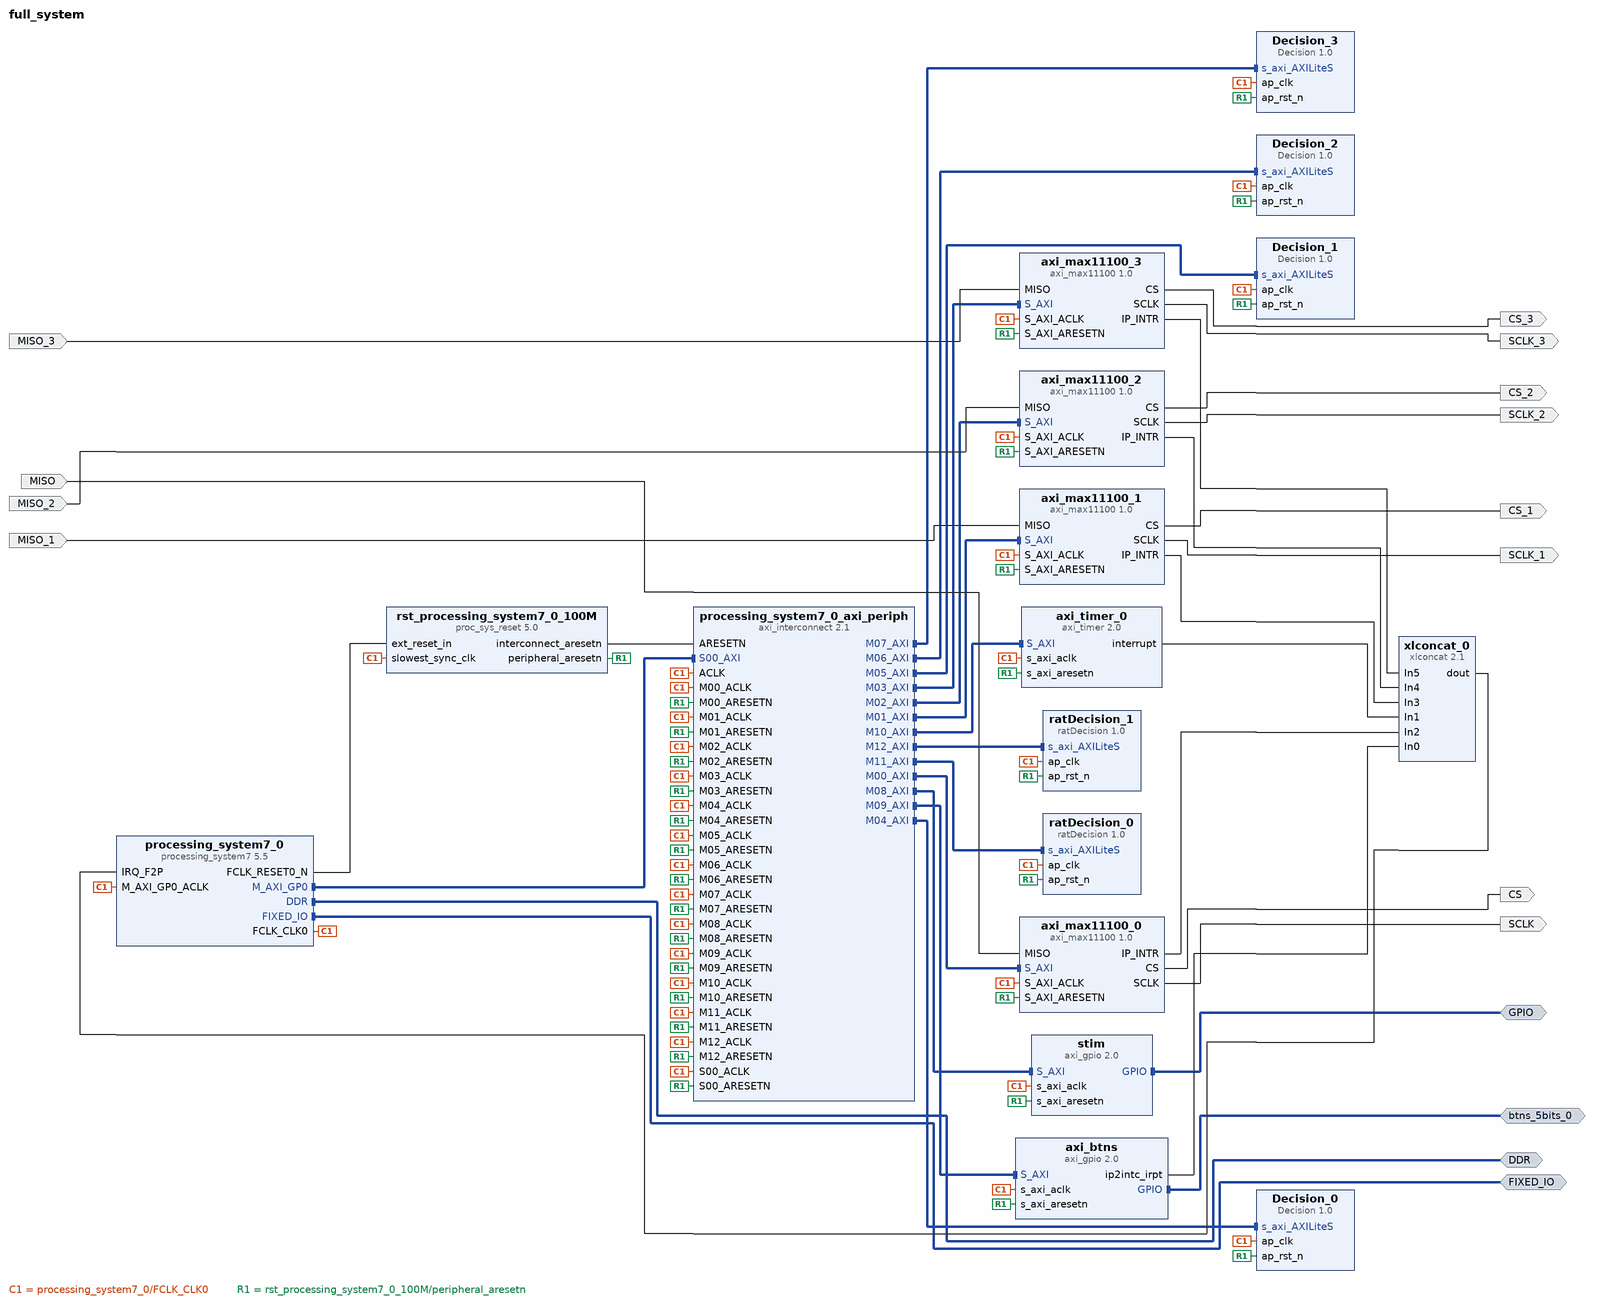
[diagram p0: block diagram of the top level]
# Vivado block design full_system, Vivado 2016.2
create_bd_design full_system

create_bd_intf_port -mode Master -vlnv xilinx.com:interface:ddrx_rtl:1.0 DDR
create_bd_intf_port -mode Master -vlnv xilinx.com:display_processing_system7:fixedio_rtl:1.0 FIXED_IO
create_bd_intf_port -mode Master -vlnv xilinx.com:interface:gpio_rtl:1.0 btns_5bits_0
create_bd_intf_port -mode Master -vlnv xilinx.com:interface:gpio_rtl:1.0 GPIO
create_bd_port -dir O CS
create_bd_port -dir O SCLK
create_bd_port -dir I MISO
create_bd_port -dir O SCLK_1
create_bd_port -dir I MISO_1
create_bd_port -dir O CS_1
create_bd_port -dir O SCLK_2
create_bd_port -dir O CS_2
create_bd_port -dir I MISO_2
create_bd_port -dir O SCLK_3
create_bd_port -dir O CS_3
create_bd_port -dir I MISO_3

create_bd_cell -type ip -vlnv xilinx.com:ip:processing_system7:5.5 processing_system7_0
set_property -dict [list \
  CONFIG.PCW_FPGA0_PERIPHERAL_FREQMHZ 100 \
  CONFIG.PCW_USE_FABRIC_INTERRUPT 1 \
  CONFIG.PCW_IRQ_F2P_INTR 1 \
  CONFIG.PCW_UART1_PERIPHERAL_ENABLE 1 \
] [get_bd_cells processing_system7_0]
create_bd_cell -type ip -vlnv PaceAce:user:axi_max11100:1.0 axi_max11100_0
set_property -dict {CONFIG.C_S_AXI_ADDR_WIDTH 32} [get_bd_cells axi_max11100_0]
create_bd_cell -type ip -vlnv PaceAce:user:axi_max11100:1.0 axi_max11100_1
create_bd_cell -type ip -vlnv PaceAce:user:axi_max11100:1.0 axi_max11100_2
set_property -dict {CONFIG.C_S_AXI_ADDR_WIDTH 32} [get_bd_cells axi_max11100_2]
create_bd_cell -type ip -vlnv PaceAce:user:axi_max11100:1.0 axi_max11100_3
set_property -dict {CONFIG.C_S_AXI_ADDR_WIDTH 32} [get_bd_cells axi_max11100_3]
create_bd_cell -type ip -vlnv xilinx.com:ip:axi_gpio:2.0 stim
set_property -dict [list \
  CONFIG.C_GPIO_WIDTH 16 \
  CONFIG.C_ALL_INPUTS 0 \
  CONFIG.C_INTERRUPT_PRESENT 0 \
  CONFIG.USE_BOARD_FLOW true \
  CONFIG.GPIO_BOARD_INTERFACE Custom \
  CONFIG.C_ALL_OUTPUTS 1 \
] [get_bd_cells stim]
create_bd_cell -type ip -vlnv xilinx.com:ip:axi_gpio:2.0 axi_btns
set_property -dict [list \
  CONFIG.C_INTERRUPT_PRESENT 1 \
  CONFIG.USE_BOARD_FLOW true \
  CONFIG.GPIO_BOARD_INTERFACE btns_5bits \
] [get_bd_cells axi_btns]
create_bd_cell -type ip -vlnv xilinx.com:ip:axi_timer:2.0 axi_timer_0
create_bd_cell -type ip -vlnv xilinx.com:ip:xlconcat:2.1 xlconcat_0
set_property -dict {CONFIG.NUM_PORTS 6} [get_bd_cells xlconcat_0]
create_bd_cell -type ip -vlnv xilinx.com:ip:axi_interconnect:2.1 processing_system7_0_axi_periph
set_property -dict {CONFIG.NUM_MI 13} [get_bd_cells processing_system7_0_axi_periph]
create_bd_cell -type ip -vlnv xilinx.com:ip:proc_sys_reset:5.0 rst_processing_system7_0_100M
create_bd_cell -type ip -vlnv PaceAce:PaceAce:Decision:1.0 Decision_0
create_bd_cell -type ip -vlnv PaceAce:PaceAce:Decision:1.0 Decision_1
create_bd_cell -type ip -vlnv PaceAce:PaceAce:Decision:1.0 Decision_2
create_bd_cell -type ip -vlnv PaceAce:PaceAce:Decision:1.0 Decision_3
create_bd_cell -type ip -vlnv PaceAce:hls:ratDecision:1.0 ratDecision_0
create_bd_cell -type ip -vlnv PaceAce:hls:ratDecision:1.0 ratDecision_1

# ---- connections ----

connect_bd_intf_net [get_bd_intf_pins processing_system7_0/M_AXI_GP0] [get_bd_intf_pins processing_system7_0_axi_periph/S00_AXI]
connect_bd_intf_net [get_bd_intf_pins processing_system7_0_axi_periph/M00_AXI] [get_bd_intf_pins axi_max11100_0/S_AXI]
connect_bd_intf_net [get_bd_intf_pins processing_system7_0_axi_periph/M01_AXI] [get_bd_intf_pins axi_max11100_1/S_AXI]
connect_bd_intf_net [get_bd_intf_pins processing_system7_0_axi_periph/M02_AXI] [get_bd_intf_pins axi_max11100_2/S_AXI]
connect_bd_intf_net [get_bd_intf_pins processing_system7_0_axi_periph/M03_AXI] [get_bd_intf_pins axi_max11100_3/S_AXI]
connect_bd_intf_net [get_bd_intf_pins processing_system7_0_axi_periph/M08_AXI] [get_bd_intf_pins stim/S_AXI]
connect_bd_intf_net [get_bd_intf_pins processing_system7_0_axi_periph/M09_AXI] [get_bd_intf_pins axi_btns/S_AXI]
connect_bd_intf_net [get_bd_intf_pins processing_system7_0_axi_periph/M10_AXI] [get_bd_intf_pins axi_timer_0/S_AXI]
connect_bd_intf_net [get_bd_intf_pins processing_system7_0_axi_periph/M04_AXI] [get_bd_intf_pins Decision_0/s_axi_AXILiteS]
connect_bd_intf_net [get_bd_intf_pins processing_system7_0_axi_periph/M05_AXI] [get_bd_intf_pins Decision_1/s_axi_AXILiteS]
connect_bd_intf_net [get_bd_intf_pins processing_system7_0_axi_periph/M06_AXI] [get_bd_intf_pins Decision_2/s_axi_AXILiteS]
connect_bd_intf_net [get_bd_intf_pins processing_system7_0_axi_periph/M07_AXI] [get_bd_intf_pins Decision_3/s_axi_AXILiteS]
connect_bd_intf_net [get_bd_intf_pins processing_system7_0_axi_periph/M11_AXI] [get_bd_intf_pins ratDecision_0/s_axi_AXILiteS]
connect_bd_intf_net [get_bd_intf_pins processing_system7_0_axi_periph/M12_AXI] [get_bd_intf_pins ratDecision_1/s_axi_AXILiteS]
connect_bd_intf_net [get_bd_intf_ports DDR] [get_bd_intf_pins processing_system7_0/DDR]
connect_bd_intf_net [get_bd_intf_ports FIXED_IO] [get_bd_intf_pins processing_system7_0/FIXED_IO]
connect_bd_intf_net -intf_net axi_gpio_1_GPIO [get_bd_intf_ports btns_5bits_0] [get_bd_intf_pins axi_btns/GPIO]
connect_bd_intf_net -intf_net axi_gpio_0_GPIO [get_bd_intf_ports GPIO] [get_bd_intf_pins stim/GPIO]
connect_bd_net [get_bd_pins processing_system7_0/FCLK_CLK0] \
  [get_bd_pins processing_system7_0/M_AXI_GP0_ACLK] [get_bd_pins rst_processing_system7_0_100M/slowest_sync_clk] \
  [get_bd_pins axi_max11100_0/S_AXI_ACLK] [get_bd_pins axi_max11100_1/S_AXI_ACLK] [get_bd_pins axi_max11100_2/S_AXI_ACLK] \
  [get_bd_pins axi_max11100_3/S_AXI_ACLK] [get_bd_pins stim/s_axi_aclk] [get_bd_pins axi_btns/s_axi_aclk] \
  [get_bd_pins axi_timer_0/s_axi_aclk] [get_bd_pins Decision_0/ap_clk] [get_bd_pins Decision_1/ap_clk] \
  [get_bd_pins Decision_2/ap_clk] [get_bd_pins Decision_3/ap_clk] [get_bd_pins processing_system7_0_axi_periph/S00_ACLK] \
  [get_bd_pins processing_system7_0_axi_periph/ACLK] [get_bd_pins processing_system7_0_axi_periph/M00_ACLK] \
  [get_bd_pins processing_system7_0_axi_periph/M01_ACLK] [get_bd_pins processing_system7_0_axi_periph/M02_ACLK] \
  [get_bd_pins processing_system7_0_axi_periph/M03_ACLK] [get_bd_pins processing_system7_0_axi_periph/M04_ACLK] \
  [get_bd_pins processing_system7_0_axi_periph/M05_ACLK] [get_bd_pins processing_system7_0_axi_periph/M06_ACLK] \
  [get_bd_pins processing_system7_0_axi_periph/M07_ACLK] [get_bd_pins processing_system7_0_axi_periph/M08_ACLK] \
  [get_bd_pins processing_system7_0_axi_periph/M09_ACLK] [get_bd_pins processing_system7_0_axi_periph/M10_ACLK] \
  [get_bd_pins ratDecision_0/ap_clk] [get_bd_pins processing_system7_0_axi_periph/M11_ACLK] \
  [get_bd_pins ratDecision_1/ap_clk] [get_bd_pins processing_system7_0_axi_periph/M12_ACLK]
connect_bd_net [get_bd_pins processing_system7_0/FCLK_RESET0_N] [get_bd_pins rst_processing_system7_0_100M/ext_reset_in]
connect_bd_net [get_bd_pins rst_processing_system7_0_100M/peripheral_aresetn] \
  [get_bd_pins axi_max11100_0/S_AXI_ARESETN] [get_bd_pins axi_max11100_1/S_AXI_ARESETN] \
  [get_bd_pins axi_max11100_2/S_AXI_ARESETN] [get_bd_pins axi_max11100_3/S_AXI_ARESETN] [get_bd_pins stim/s_axi_aresetn] \
  [get_bd_pins axi_btns/s_axi_aresetn] [get_bd_pins axi_timer_0/s_axi_aresetn] [get_bd_pins Decision_0/ap_rst_n] \
  [get_bd_pins Decision_1/ap_rst_n] [get_bd_pins Decision_2/ap_rst_n] [get_bd_pins Decision_3/ap_rst_n] \
  [get_bd_pins processing_system7_0_axi_periph/S00_ARESETN] [get_bd_pins processing_system7_0_axi_periph/M00_ARESETN] \
  [get_bd_pins processing_system7_0_axi_periph/M01_ARESETN] [get_bd_pins processing_system7_0_axi_periph/M02_ARESETN] \
  [get_bd_pins processing_system7_0_axi_periph/M03_ARESETN] [get_bd_pins processing_system7_0_axi_periph/M04_ARESETN] \
  [get_bd_pins processing_system7_0_axi_periph/M05_ARESETN] [get_bd_pins processing_system7_0_axi_periph/M06_ARESETN] \
  [get_bd_pins processing_system7_0_axi_periph/M07_ARESETN] [get_bd_pins processing_system7_0_axi_periph/M08_ARESETN] \
  [get_bd_pins processing_system7_0_axi_periph/M09_ARESETN] [get_bd_pins processing_system7_0_axi_periph/M10_ARESETN] \
  [get_bd_pins ratDecision_0/ap_rst_n] [get_bd_pins processing_system7_0_axi_periph/M11_ARESETN] \
  [get_bd_pins ratDecision_1/ap_rst_n] [get_bd_pins processing_system7_0_axi_periph/M12_ARESETN]
connect_bd_net [get_bd_pins rst_processing_system7_0_100M/interconnect_aresetn] [get_bd_pins processing_system7_0_axi_periph/ARESETN]
connect_bd_net [get_bd_pins axi_max11100_0/CS] [get_bd_ports CS]
connect_bd_net [get_bd_pins axi_max11100_0/SCLK] [get_bd_ports SCLK]
connect_bd_net [get_bd_ports MISO] [get_bd_pins axi_max11100_0/MISO]
connect_bd_net [get_bd_pins axi_max11100_1/SCLK] [get_bd_ports SCLK_1]
connect_bd_net -net MISO_1_1 [get_bd_ports MISO_1] [get_bd_pins axi_max11100_1/MISO]
connect_bd_net [get_bd_pins axi_max11100_1/CS] [get_bd_ports CS_1]
connect_bd_net [get_bd_pins axi_max11100_2/SCLK] [get_bd_ports SCLK_2]
connect_bd_net [get_bd_pins axi_max11100_2/CS] [get_bd_ports CS_2]
connect_bd_net -net MISO_2_1 [get_bd_ports MISO_2] [get_bd_pins axi_max11100_2/MISO]
connect_bd_net [get_bd_pins axi_max11100_3/SCLK] [get_bd_ports SCLK_3]
connect_bd_net [get_bd_pins axi_max11100_3/CS] [get_bd_ports CS_3]
connect_bd_net -net MISO_3_1 [get_bd_ports MISO_3] [get_bd_pins axi_max11100_3/MISO]
connect_bd_net [get_bd_pins xlconcat_0/dout] [get_bd_pins processing_system7_0/IRQ_F2P]
connect_bd_net -net axi_gpio_1_ip2intc_irpt [get_bd_pins axi_btns/ip2intc_irpt] [get_bd_pins xlconcat_0/In0]
connect_bd_net [get_bd_pins axi_timer_0/interrupt] [get_bd_pins xlconcat_0/In1]
connect_bd_net [get_bd_pins axi_max11100_0/IP_INTR] [get_bd_pins xlconcat_0/In2]
connect_bd_net [get_bd_pins axi_max11100_1/IP_INTR] [get_bd_pins xlconcat_0/In3]
connect_bd_net [get_bd_pins axi_max11100_2/IP_INTR] [get_bd_pins xlconcat_0/In4]
connect_bd_net [get_bd_pins axi_max11100_3/IP_INTR] [get_bd_pins xlconcat_0/In5]

# ---- address map ----
assign_bd_address -offset 0x40000000 -range 64K -target_address_space [get_bd_addr_spaces processing_system7_0/Data] [get_bd_addr_segs axi_max11100_0/S_AXI/reg0]
assign_bd_address -offset 0x41200000 -range 64K -target_address_space [get_bd_addr_spaces processing_system7_0/Data] [get_bd_addr_segs stim/S_AXI/Reg]
assign_bd_address -offset 0x41210000 -range 64K -target_address_space [get_bd_addr_spaces processing_system7_0/Data] [get_bd_addr_segs axi_btns/S_AXI/Reg]
assign_bd_address -offset 0x42800000 -range 64K -target_address_space [get_bd_addr_spaces processing_system7_0/Data] [get_bd_addr_segs axi_timer_0/S_AXI/Reg]
assign_bd_address -offset 0x43C00000 -range 64K -target_address_space [get_bd_addr_spaces processing_system7_0/Data] [get_bd_addr_segs axi_max11100_1/S_AXI/reg0]
assign_bd_address -offset 0x43C10000 -range 64K -target_address_space [get_bd_addr_spaces processing_system7_0/Data] [get_bd_addr_segs Decision_0/s_axi_AXILiteS/Reg]
assign_bd_address -offset 0x43C20000 -range 64K -target_address_space [get_bd_addr_spaces processing_system7_0/Data] [get_bd_addr_segs Decision_1/s_axi_AXILiteS/Reg]
assign_bd_address -offset 0x43C30000 -range 64K -target_address_space [get_bd_addr_spaces processing_system7_0/Data] [get_bd_addr_segs Decision_2/s_axi_AXILiteS/Reg]
assign_bd_address -offset 0x43C40000 -range 64K -target_address_space [get_bd_addr_spaces processing_system7_0/Data] [get_bd_addr_segs Decision_3/s_axi_AXILiteS/Reg]
assign_bd_address -offset 0x43C50000 -range 64K -target_address_space [get_bd_addr_spaces processing_system7_0/Data] [get_bd_addr_segs ratDecision_0/s_axi_AXILiteS/Reg]
assign_bd_address -offset 0x43C60000 -range 64K -target_address_space [get_bd_addr_spaces processing_system7_0/Data] [get_bd_addr_segs ratDecision_1/s_axi_AXILiteS/Reg]
assign_bd_address -offset 0x50000000 -range 64K -target_address_space [get_bd_addr_spaces processing_system7_0/Data] [get_bd_addr_segs axi_max11100_2/S_AXI/reg0]
assign_bd_address -offset 0x50020000 -range 64K -target_address_space [get_bd_addr_spaces processing_system7_0/Data] [get_bd_addr_segs axi_max11100_3/S_AXI/reg0]

validate_bd_design
save_bd_design
